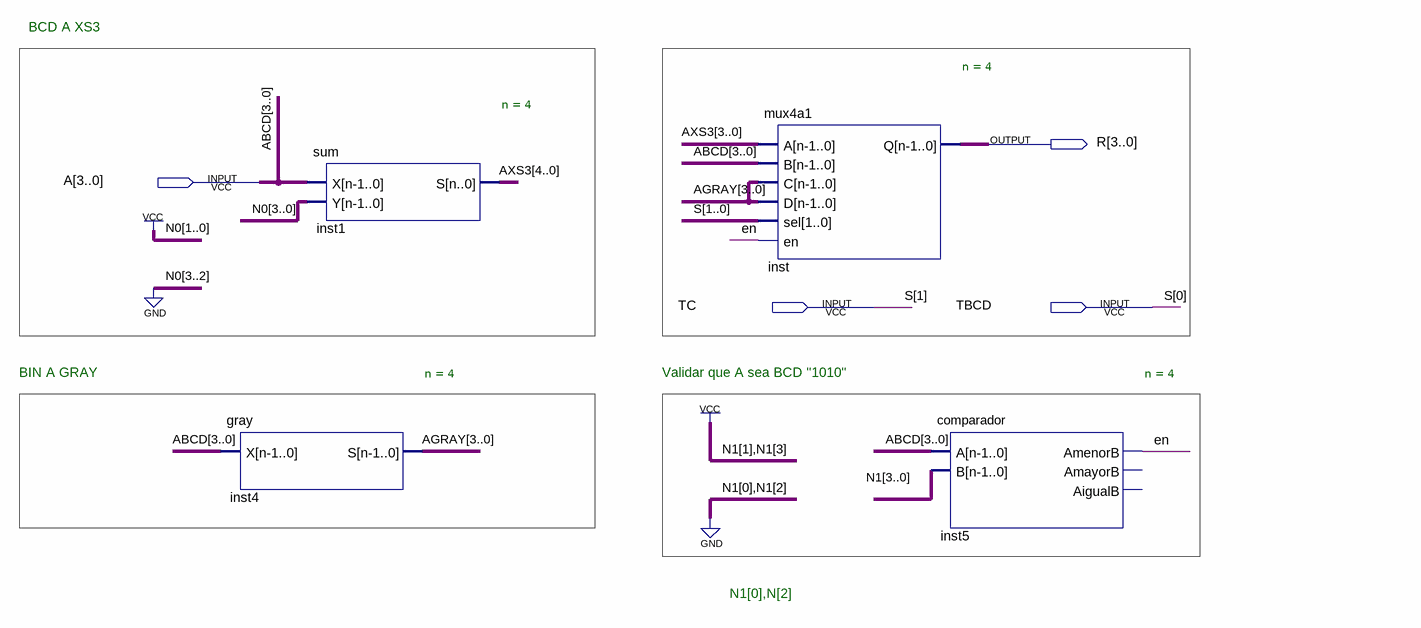
[diagram p0: schematic sheet]
// Quartus schematic DisenoModular.bdf as structural Verilog: 4 symbols, 4 pins
module DisenoModular (
  input  [3:0] A,
  input  TC,
  input  TBCD,
  output [3:0] R
);

  wire en;
  wire [3:0] AGRAY;
  wire [4:0] AXS3;

  gray #(.n(4)) inst4 (.X(A), .S(AGRAY));
  sum #(.n(4)) inst1 (.X(A), .Y(4'b0011), .S(AXS3));
  mux4a1 #(.n(4)) inst (.A(AXS3[3:0]), .B(A), .C(AGRAY), .D(AGRAY), .sel({TC, TBCD}), .en(en), .Q(R));
  comparador #(.n(4)) inst5 (.A(A), .B(4'b1010), .AmenorB(en));  // open: AmayorB, AigualB

  // Other names for the same wires on the sheet: ABCD[3:0] = A; S[1:0] = {TC, TBCD}

  // Notes on the sheet:
  //   BCD A XS3
  //   BIN A GRAY
  //   Validar que A sea BCD "1010"
  //   N1[0],N[2]
endmodule
